# Altium project bogo_board.PrjPcb (part 3 of 4)
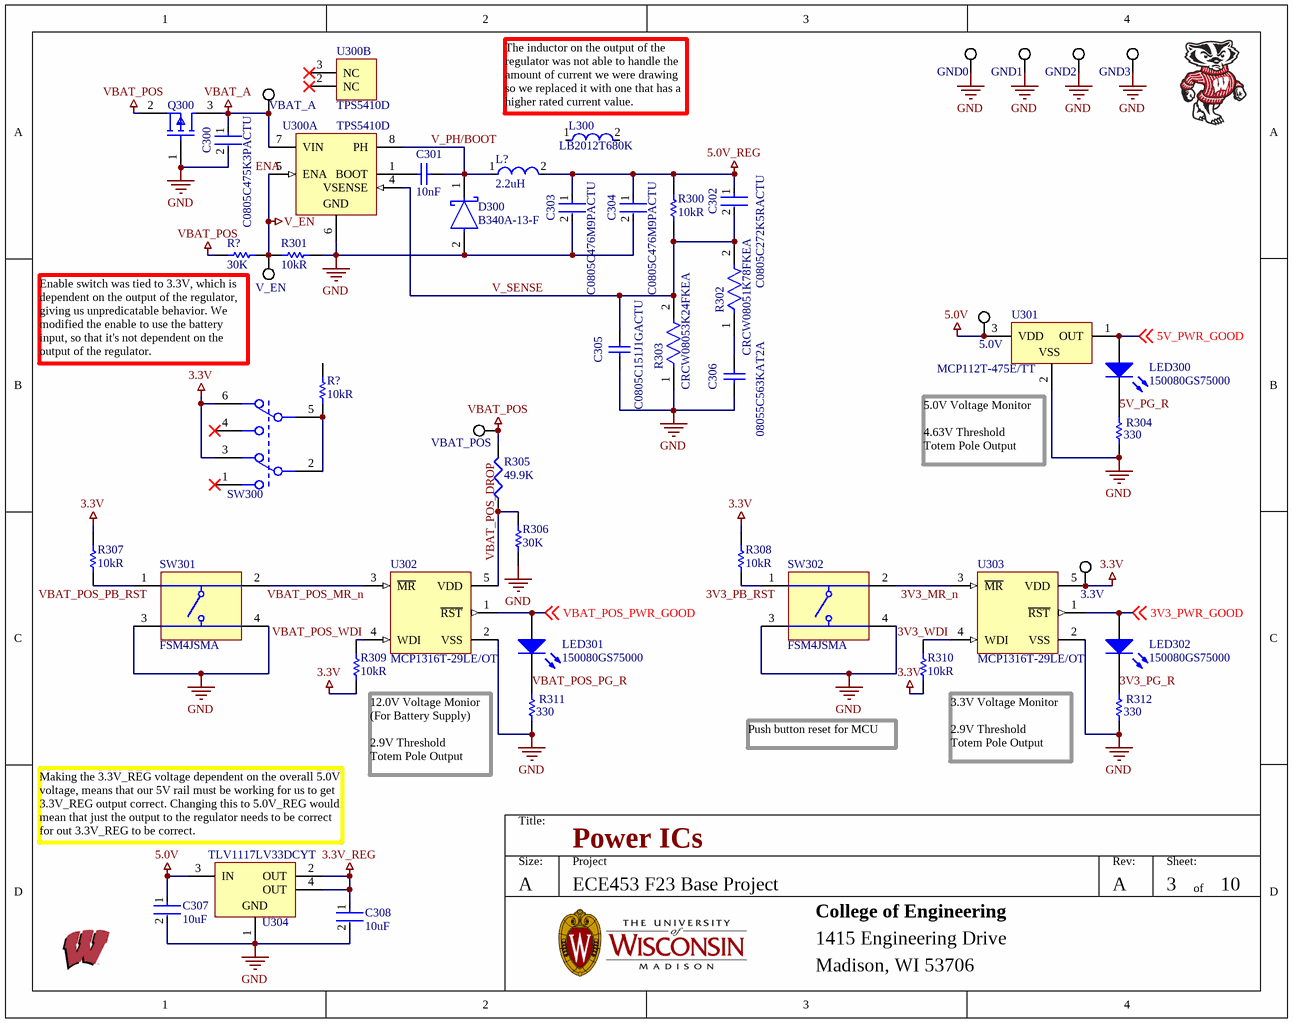
[diagram p11: 03_Power_ICs.SchDoc]

## Sheet 03_Power_ICs.SchDoc: Power ICs (continued)

### Library data of the parts (continued)
SW300 = JS202011SCQN: C & K COMPONENTS - JS202011SCQN - SWITCH, DPDT, 0.6A, 6VDC, SMD; Manufacturer 1: ITT C&K; Actuator Material: Nylon,Polyamide,PA46; Actuator Color: Black; Voltage Rating (DC): 6V; Current Rating: 300mA; Electrical Life: 5000Cycles; Switch Function: On-On; Contact Resistance: 70mR; Switch Travel: 2mm; Actuator Type: Standard; Supplier 1: Digi-Key; Supplier Part Number 1: 401-2002-1-ND; Manufacturer Part Number 1: JS202011SCQN; RoHS: Yes; Category: Slide Switches; Stock 1: 21096; Pricing 1: 1=0.55000, 10=0.53000, 25=0.51040, 100=0.44180, 250=0.40252, 500=0.37306 (USD); Mount: Surface Mount; Contact Plating: Silver; Contact Material: Copper Alloy; Housing Material: Nylon; Min Operating Temperature: -20°C; Max Operating Temperature: 85°C; Throw Configuration: DPDT; Packaging: Tape and Reel; Package Quantity: 1; Termination: Gull Wing; Max Voltage Rating (DC): 6V; Series: JS; Max Current Rating: 300mA; Contact Current Rating: 300mA; Orientation: Vertical; Length: 9mm; Depth: 7.5mm; Actuator Length: 2mm; Radiation Hardening: No; REACH SVHC: No SVHC; Lead Free: Lead Free; Flammability Rating: UL94 V-2; ComponentLink1URL: https://datasheet.ciiva.com/2889/js-29aug13-2889127.pdf?src-supplier=Digi-Key; ComponentLink1Description: https://datasheet.ciiva.com/2889/js-29aug13-2889127.pdf?src-supplier=Digi-Key; ComponentLink2URL: https://datasheet.ciiva.com/23829/1707718-23829488.pdf?src-supplier=Newark; ComponentLink2Description: https://datasheet.ciiva.com/23829/1707718-23829488.pdf?src-supplier=Newark; ComponentLink3URL: https://datasheet.ciiva.com/8625/js-9dec14-8625470.pdf?src-supplier=Avnet; ComponentLink3Description: https://datasheet.ciiva.com/8625/js-9dec14-8625470.pdf?src-supplier=Avnet; ComponentLink4URL: https://datasheet.ciiva.com/2889/js-15sept15-2889128.pdf?src-supplier=Digi-Key; ComponentLink4Description: https://datasheet.ciiva.com/2889/js-15sept15-2889128.pdf?src-supplier=Digi-Key; ComponentLink5URL: https://datasheet.ciiva.com/2889/js-15sept15-2889129.pdf?src-supplier=Digi-Key; ComponentLink5Description: https://datasheet.ciiva.com/2889/js-15sept15-2889129.pdf?src-supplier=Digi-Key; ComponentLink6URL: https://datasheet.ciiva.com/22630/1707718-22630697.pdf?src-supplier=Element14; ComponentLink6Description: https://datasheet.ciiva.com/22630/1707718-22630697.pdf?src-supplier=Element14
SW301 SW302 = CMP-2000-05602-2: Swicth, SPST, 24 V, -35 to 85 degC, 4-Pin SMD, RoHS, Tape and Reel; Manufacturer: TE Connectivity; Switch Travel: 0.25mm; Mechanical Life: 100000Cycles; Contact Current Rating: 50mA; Operating Force: 1.57N; Actuator Material: Polyamide; Contact Resistance: 100mOhm; Voltage Rating: 24V; Illumination Type: Illuminated; Actuator Length: 0.055inch; Max Voltage Rating (DC): 12V; Case\/Package: SMD/SMT; Switch Function: Off-Mom; Actuator Type: Standard; Insulation Resistance: 100MR; Orientation: Straight; Datasheet URL: http://www.te.com/commerce/DocumentDelivery/DDEController?Action=showdoc&DocId=Customer+Drawing%7F2-1437565-7%7FV%7Fpdf%7FEnglish%7FENG_CD_2-1437565-7_V.pdf%7F4-1437565-2; Min Operating Temperature: -35degC; Packaging: LoosePiece; Termination: GullWing; Throw Configuration: SPST; Package Description: 4-Pin Surface Mount Device, Body 6 x 6 mm, Pitch 4.5 mm; Mounting Technology: SurfaceMount; Contact Plating: Silver; Datasheet Version: Rev. V, 02/2015; RoHSCompliant: true; Max Operating Temperature: 85degC; Length: 6mm; Voltage Rating (DC): 24V; Electrical Life: 100000Cycles; Current Rating: 50mA; Package Quantity: 750; Mount: SurfaceMount; Package Reference: FSM4JSMA; Manufacturer URL: http://www.te.com/; Width: 6mm; REACH SVHC: Unknown; Contact Material: CopperAlloy; Supplier 1: Digi-Key; Supplier Part Number 1: 450-1129-ND; Manufacturer 1: TE Connectivity; Manufacturer Part Number 1: FSM4JSMA; RoHS: Yes; Category: Pushbutton Switches; Stock 1: 65608; Pricing 1: 1=0.27000, 10=0.26300, 25=0.24960, 100=0.22600, 250=0.20604, 750=0.19152, 1500=0.16339, 3000=0.15885, 5250=0.14977 (USD); Case/Package: SMD/SMT; Color: Black; Series: FSMJSMA; Max Current Rating: 50mA; Depth: 10mm; Radiation Hardening: No; RoHS Compliant: Yes; Lead Free: Lead Free; ELV: Compliant; Supplier: Newark; Supplier Part Number: 27AC5877; Manufacturer Part Number: FSM4JSMA; Stock: 46743; Pricing: 1=0.292, 10=0.274, 25=0.255, 100=0.232, 500=0.2, 1000=0.166 (USD); Reach SVHC Compliant: Unknown
U300 = CMP-0323-00191-3: Buck Step Down Regulator with 5.5 to 36 V Input and 1.23 to 31 V Output, -40 to 125 degC, 8-Pin SOIC (D), Green (RoHS & no Sb/Br); Manufacturer: Texas Instruments; Switch Current Limit(Typ)(A): 1.2; Iq(Typ)(mA): 3; Rating: Catalog; Duty Cycle(Max)(%): 87.5; Iout(Max)(A): 1; Vin(Max)(V): 36; Vout(Min)(V): 1.23; Vout(Max)(V): 31; SubFamily: Step-Down Regulator; Vin(Min)(V): 5.5; Package Body Material: Plastic; Throw Configuration: SWITCHING REGULATOR; Control Technique: PULSE WIDTH MODULATION; Max Supply Voltage: 36V; Min Input Voltage: 5.5V; Max Output current: 1.8A; Frequency: 600kHz; Control Mode: VOLTAGE-MODE; Package Equivalence Code: SOP8,.25; Qualification Status: Not Qualified; ComponentLink2URL: http://www.ti.com/litv/pdf/msoi002j; PartNumber: TPS5410D; DatasheetVersion: SLVS675A; PackageDescription: 8-Pin Plastic Small Outline Integrated Circuit, 4.9 x 3.9 mm, Pitch 1.27 mm Pitch; Topology: Buck; PackageVersion: revM, Jun-2011; Code_JEDEC: MS-012AA; ComponentLink3Description: URL Link1; ComponentLink1Description: Datasheet; ComponentLink1URL: http://www.ti.com/general/docs/lit/getliterature.tsp?genericPartNumber=TPS5410&fileType=pdf; Eco-Plan: Green (RoHS & no Sb/Br); ComponentLink3URL: Samples URL:http://www.ti.com/product/tps5410#samples; Mounting Technology: Surface Mount; ComponentLink2Description: Package Specification; PackageReference: D0008A; Regulated Outputs(#): 1; Supplier: Digi-Key; Supplier Part Number: 296-20787-5-ND; Manufacturer Part Number: TPS5410D; RoHS: Yes; Category: Voltage Regulators - Switching; Stock: 6339; Pricing: 1=3.42, 10=3.072, 25=2.9044, 100=2.517, 250=2.38796, 500=2.1427, 1000=1.80709, 2500=1.71674, 5000=1.6522 (USD); Case/Package: SOP; Pins: 8; Package Shape: Rectangular; Terminal Finish: Nickel; Min Operating Temperature: -40°C; Max Operating Temperature: 125°C; JESD-609 Code: e4; Moisture Sensitivity Level: 2; Channels: 1; Package Style: SMALL OUTLINEMeter; Surface Mount: Yes; Switcher Configuration: BUCK; Terminal Form: Gull Wing; Terminal Position: DUAL; Peak Reflow Temperature (Cel): 260°C; JESD-30 Code: R-PDSO-G8; Length: 4.9mm; Width: 3.9mm; Height - Seated (Max): 1.75mm; Terminal Pitch: 1.27mm; Temperature Grade: AUTOMOTIVE; Reach SVHC Compliant: Yes; RoHS Compliant: Yes; ComponentLink4URL: https://www.ti.com:443/lit/ds/symlink/tps5410.pdf?src-supplier=IHS+Markit; ComponentLink4Description: https://www.ti.com:443/lit/ds/symlink/tps5410.pdf?src-supplier=IHS+Markit; ComponentLink5URL: https://datasheet.ciiva.com/15113/getdatasheetpartid-224296-15113874.pdf?src-supplier=Verical; ComponentLink5Description: https://datasheet.ciiva.com/15113/getdatasheetpartid-224296-15113874.pdf?src-supplier=Verical; ComponentLink6URL: https://datasheet.ciiva.com/2026/tps5410-2026736.pdf?src-supplier=Digi-Key; ComponentLink6Description: https://datasheet.ciiva.com/2026/tps5410-2026736.pdf?src-supplier=Digi-Key; ComponentLink7URL: https://datasheet.ciiva.com/27056/2003563-27056017.pdf?src-supplier=Jameco; ComponentLink7Description: https://datasheet.ciiva.com/27056/2003563-27056017.pdf?src-supplier=Jameco; ComponentLink8URL: https://datasheet.ciiva.com/7993/1851017-7993797.pdf?src-supplier=Element14; ComponentLink8Description: https://datasheet.ciiva.com/7993/1851017-7993797.pdf?src-supplier=Element14
U301 = CMP-0130-00073-1: 1.75Î¼A Micropower Voltage Detector, Push-Pull Output, 4.63V, 3-Pin SOT-23, Extended Temperature, Tape and Reel; Manufacturer: Microchip; Package Body Material: Plastic; Adjustable Threshold: No; Throw Configuration: POWER SUPPLY SUPPORT CIRCUIT; Number of Channels: 1; Package Equivalence Code: TO-236; Power Supplies: 1/5.5V; Supply Current-Max (Isup): 1.75uA; Max Supply Voltage: 5.5V; Min Supply Voltage: 1V; Time @ Peak Reflow Temperature-Max (s): 40s; Qualification Status: Not Qualified; PackageReference: SOT-23-TT3; DatasheetVersion: revD, Jun-2005; Code_IPC: SOT23-3; PackageDescription: 3-Lead Plastic Small Outline Transistor (TT) [SOT-23]; PackageVersion: revBB, Aug-2009; Supplier: Digi-Key; Supplier Part Number: MCP112T-475E/TTCT-ND; Manufacturer Part Number: MCP112T-475E/TT; RoHS: Yes; Category: Voltage Supervisors; Stock: 2856; Pricing: 1=0.6, 25=0.5, 100=0.46 (USD); Case/Package: TSSOP; Pins: 3; Package Shape: Rectangular; Terminal Finish: Tin; Min Operating Temperature: -40°C; Max Operating Temperature: 125°C; JESD-609 Code: e3; JESD-30 Code: R-PDSO-G3; Moisture Sensitivity Level: 1; Channels: 1; Package Style: SMALL OUTLINE, THIN PROFILE, SHRINK PITCHMeter; Peak Reflow Temperature (Cel): 260°C; Surface Mount: Yes; Terminal Form: Gull Wing; Terminal Position: DUAL; Threshold Voltage-Nom: 4.63V; Length: 2.92mm; Width: 1.3mm; Height - Seated (Max): 1.12mm; Terminal Pitch: 0.96mm; Temperature Grade: AUTOMOTIVE; Reach SVHC Compliant: Yes; RoHS Compliant: Yes; ComponentLink1URL: https://datasheet.ciiva.com:443/pdfs/VipMasterIC/IC/MCHP/MCHP-S-A0002312823/MCHP-S-A0002312823-1.pdf?src-supplier=IHS+Markit; ComponentLink1Description: https://datasheet.ciiva.com:443/pdfs/VipMasterIC/IC/MCHP/MCHP-S-A0002312823/MCHP-S-A0002312823-1.pdf?src-supplier=IHS+Markit; ComponentLink2URL: https://datasheet.ciiva.com/1974/21889d-1974510.pdf?src-supplier=Digi-Key; ComponentLink2Description: https://datasheet.ciiva.com/1974/21889d-1974510.pdf?src-supplier=Digi-Key; ComponentLink3URL: https://datasheet.ciiva.com/1974/21889d-1974511.pdf?src-supplier=Digi-Key; ComponentLink3Description: https://datasheet.ciiva.com/1974/21889d-1974511.pdf?src-supplier=Digi-Key; ComponentLink4URL: https://datasheet.ciiva.com/1974/21889d-1974512.pdf?src-supplier=Digi-Key; ComponentLink4Description: https://datasheet.ciiva.com/1974/21889d-1974512.pdf?src-supplier=Digi-Key; ComponentLink5URL: https://datasheet.ciiva.com/9215/21889d-9215465.pdf?src-supplier=Avnet; ComponentLink5Description: https://datasheet.ciiva.com/9215/21889d-9215465.pdf?src-supplier=Avnet; ComponentLink6URL: https://datasheet.ciiva.com/1170/21889d-1170331.pdf?src-supplier=Element14; ComponentLink6Description: https://datasheet.ciiva.com/1170/21889d-1170331.pdf?src-supplier=Element14
U302 U303 = CMP-0138-00207-1: Voltage Supervisor, 5-Pin SOT-23, Extended Temperature, Tape and Reel; Manufacturer: Microchip; Min Supply Voltage: 1V; Max Supply Voltage: 5.5V; Number of Voltages Monitored: 1; Overvoltage Threshold: 2.944V; Undervoltage Threshold: 2.857V; Operating Supply Current: 10uA; Reset: Active Low; Reset Timeout: 140ms; Threshold Voltage: 2.9V; Watchdog Timer: Yes; Quiescent Current: 1uA; Max Output current: 10mA; Max Power Dissipation: 240mW; Output: TOTEM-POLE; PackageReference: SOT-23-OT5; Code_IPC: SOT23-5; DatasheetVersion: revB, Oct-2007; PackageDescription: 5-Lead Plastic Small Outline Transistor (OT) [SOT-23]; PackageVersion: revBB, Aug-2009; Supplier: Newark; Supplier Part Number: 34M7402; Manufacturer Part Number: MCP1316T-29LE/OT; RoHS: Yes; Category: Voltage Supervisors; Stock: 8598; Pricing: 1=0.877, 10=0.805, 25=0.732 (USD); Mounting Technology: Surface Mount; Case/Package: SOT-23; Pins: 5; Min Operating Temperature: -40°C; Max Operating Temperature: 125°C; Packaging: Tape and Reel; Type: Simple Reset/Power-On Reset; Package Quantity: 3000; Max Supply Current: 10uA; Max Reset Threshold Voltage: 2.944V; Min Reset Threshold Voltage: 2.857V; Supply Current: 10uA; Number of Elements: 1; Power Dissipation: 240mW; Termination: SMD/SMT; Length: 3.1mm; Width: 1.8mm; Height: 1.3mm; Radiation Hardening: No; Reach SVHC Compliant: No; Lead Free: Lead Free; RoHS Compliant: Yes; ComponentLink1URL: https://datasheet.ciiva.com/1969/21985d-1969832.pdf?src-supplier=Digi-Key; ComponentLink1Description: https://datasheet.ciiva.com/1969/21985d-1969832.pdf?src-supplier=Digi-Key; ComponentLink2URL: https://datasheet.ciiva.com/1969/21985d-1969833.pdf?src-supplier=Digi-Key; ComponentLink2Description: https://datasheet.ciiva.com/1969/21985d-1969833.pdf?src-supplier=Digi-Key; ComponentLink3URL: https://datasheet.ciiva.com/14562/70045388-14562791.pdf?src-supplier=Allied+Electronics; ComponentLink3Description: https://datasheet.ciiva.com/14562/70045388-14562791.pdf?src-supplier=Allied+Electronics; ComponentLink4URL: https://datasheet.ciiva.com/8140/21985c-8140440.pdf?src-supplier=Avnet; ComponentLink4Description: https://datasheet.ciiva.com/8140/21985c-8140440.pdf?src-supplier=Avnet
U304 = CMP-0395-00499-2: Single Output LDO, 1 A, Fixed 3.3 V Output, 2 to 5.5 V Input, 4-pin SOT-223 (DCY), -40 to 125 degC, Green (RoHS & no Sb/Br); Manufacturer: Texas Instruments; Manufacturer Part Number: TLV1117-33CDCYR; Vout Adj(Max)(V): 3.3; Iout(Max)(A): 1; SubFamily: Single Channel LDO; Iq(Typ)(mA): 0.05; Accuracy(%): 2; Vin(Max)(V): 5.5; Vdo(Typ)(mV): 1200; Max Power Dissipation: 1.59W; Dropout Voltage: 455mV; Output Voltage: 3.3V; Output Current: 1A; Max Input Voltage: 5.5V; Min Input Voltage: 2V; Min Current Limit: 1.1A; Polarity: Positive; Quiescent Current: 50uA; Output Voltage Accuracy: 1.5%; Accuracy: 2%; Power Supply Rejection Ratio (PSRR): 75dB; Max Supply Voltage: 15V; PartNumber: TLV1117LV33DCYT; PackageReference: DCY0004A; PackageVersion: 4202506/B; ComponentLink1URL: http://www.ti.com/; DatasheetVersion: SBVS160A; Mounting Technology: Surface Mount; Fixed Output Options(V): 3.3; ComponentLink3Description: Package Specification; PackageDescription: 4-Pin Plastic Small Outline, Body 3.5 x 6.5 mm, Pitch 2.3 mm; Vout Adj(Min)(V): 3.3; ComponentLink2URL: http://www.ti.com/general/docs/lit/getliterature.tsp?genericPartNumber=TLV1117LV33&fileType=pdf; Code_JEDEC: TO-261; ComponentLink1Description: Manufacturer URL; Vin(Min)(V): 2; ComponentLink2Description: Datasheet; Eco-Plan: Green (RoHS & no Sb/Br); ComponentLink3URL: http://www.ti.com/litv/pdf/mpds094a; Supplier 1: Digi-Key; Supplier Part Number 1: 296-35976-1-ND; Manufacturer 1: Texas Instruments; Manufacturer Part Number 1: TLV1117LV33DCYT; RoHS: Yes; Category: Voltage Regulators - Linear; Stock 1: 1411; Pricing 1: 1=1.15000, 10=1.02600, 25=0.97360, 100=0.79970 (USD); Case/Package: SOT-223; Number of Pins: 4; Contact Plating: Tin; Min Operating Temperature: -40°C; Max Operating Temperature: 125°C; Package Quantity: 250; Packaging: Tape and Reel; Number of Outputs: 1; Nominal Output Voltage: 3.3V; Max Output Current: 1A; Number of Regulators: 1; Power Dissipation: 1.59W; Max Output Voltage: 3.3V; Min Output Voltage: 3.3V; Output Type: Fixed; Series: -; Output Configuration: Positive; Radiation Hardening: No; Reach SVHC Compliant: Yes; Lead Free: Lead Free; RoHS Compliant: Yes; ComponentLink4URL: http://www.ti.com/general/docs/lit/getliterature.tsp?genericPartNumber=TLV1117LV&&fileType=pdf&src-supplier=Farnell; ComponentLink4Description: http://www.ti.com/general/docs/lit/getliterature.tsp?genericPartNumber=TLV1117LV&&fileType=pdf&src-supplier=Farnell; ComponentLink5URL: http://www.farnell.com/datasheets/1950591.pdf?src-supplier=Element14; ComponentLink5Description: http://www.farnell.com/datasheets/1950591.pdf?src-supplier=Element14; ComponentLink6URL: http://www.ti.com/lit/ds/symlink/tlv1117lv.pdf?src-supplier=Digi-Key; ComponentLink6Description: http://www.ti.com/lit/ds/symlink/tlv1117lv.pdf?src-supplier=Digi-Key; ComponentLink7URL: http://www.ti.com/general/docs/suppproductinfo.tsp?distId=10&amp;gotoUrl=http%3A%2F%2Fwww.ti.com%2Flit%2Fgpn%2Ftlv1117lv&src-supplier=Digi-Key; ComponentLink7Description: http://www.ti.com/general/docs/suppproductinfo.tsp?distId=10&amp;gotoUrl=http%3A%2F%2Fwww.ti.com%2Flit%2Fgpn%2Ftlv1117lv&src-supplier=Digi-Key; ComponentLink8URL: http://www.ti.com/lit/gpn/tlv1117lv?src-supplier=Mouser; ComponentLink8Description: http://www.ti.com/lit/gpn/tlv1117lv?src-supplier=Mouser; ComponentLink9URL: http://www.ti.com/general/docs/lit/getliterature.tsp?genericPartNumber=TLV1117LV&&fileType=pdf&src-supplier=Avnet; ComponentLink9Description: http://www.ti.com/general/docs/lit/getliterature.tsp?genericPartNumber=TLV1117LV&&fileType=pdf&src-supplier=Avnet; ComponentLink10URL: http://components.arrow.com/part/dataview/51117919S8954709N7713?src-supplier=Arrow+Electronics; ComponentLink10Description: http://components.arrow.com/part/dataview/51117919S8954709N7713?src-supplier=Arrow+Electronics; Supplier: Newark; Supplier Part Number: 29AH1523; Pricing: 1=0.965, 10=0.923, 25=0.877, 50=0.839, 100=0.803, 250=0.777, 500=0.759, 1000=0.746 (USD); Pins: 3; ComponentLink11URL: http://www.ti.com/general/docs/lit/getliterature.tsp?genericPartNumber=TLV1117-33&amp;&amp;fileType=pdf&src-supplier=Newark; ComponentLink11Description: http://www.ti.com/general/docs/lit/getliterature.tsp?genericPartNumber=TLV1117-33&amp;&amp;fileType=pdf&src-supplier=Newark; ComponentLink12URL: http://www.ti.com/general/docs/suppproductinfo.tsp?distId=10&amp;gotoUrl=http%3A%2F%2Fwww.ti.com%2Flit%2Fgpn%2Ftlv1117&src-supplier=Digi-Key; ComponentLink12Description: http://www.ti.com/general/docs/suppproductinfo.tsp?distId=10&amp;gotoUrl=http%3A%2F%2Fwww.ti.com%2Flit%2Fgpn%2Ftlv1117&src-supplier=Digi-Key

## Sheet 10_Mechanical.SchDoc: Mechanicals
size A; Revision: A; SheetNumber: 10; SheetTotal: 10; ECE315_Project_Name: ECE453 Base Project
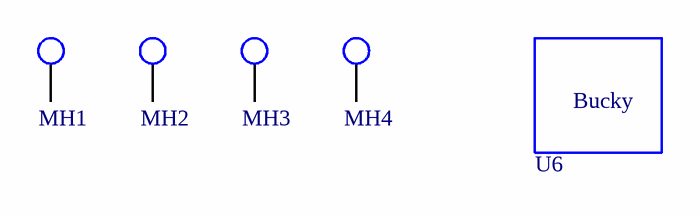
[diagram p4: 10_Mechanical.SchDoc]

### Parts
MH1  MHOLE_2_55MM  [MHOLE_2_55MM]  (value not drawn)  (no BOM)
MH2  MHOLE_2_55MM  [MHOLE_2_55MM]  (value not drawn)  (no BOM)
MH3  MHOLE_2_55MM  [MHOLE_2_55MM]  (value not drawn)  (no BOM)
MH4  MHOLE_2_55MM  [MHOLE_2_55MM]  (value not drawn)  (no BOM)
U6  Bucky  [WalkingBucky]  (value not drawn)  (no BOM)

### Nets

Not connected (* = marked no-connect by the designer): MH1 1; MH2 1; MH3 1; MH4 1

### Notes on the sheet
- Title:
- Size:
- A
- Project
- Rev:
- Sheet:
- of
- College of Engineering
- 1415 Engineering Drive
- Madison, WI 53706

### Library data of the parts
MH1-MH4 = MHOLE_2_55MM: Mounting Holde; Manufacturer Part Number: UW MTHOLE
U6 = Bucky: Bucky Badger Image; Manufacturer Part Number: UW Bucky

## Sheet 02_Connectors.SchDoc: Connectors
size A; Revision: A; SheetNumber: 2; SheetTotal: 10; ECE315_Project_Name: ECE453 Processor Mezzanine
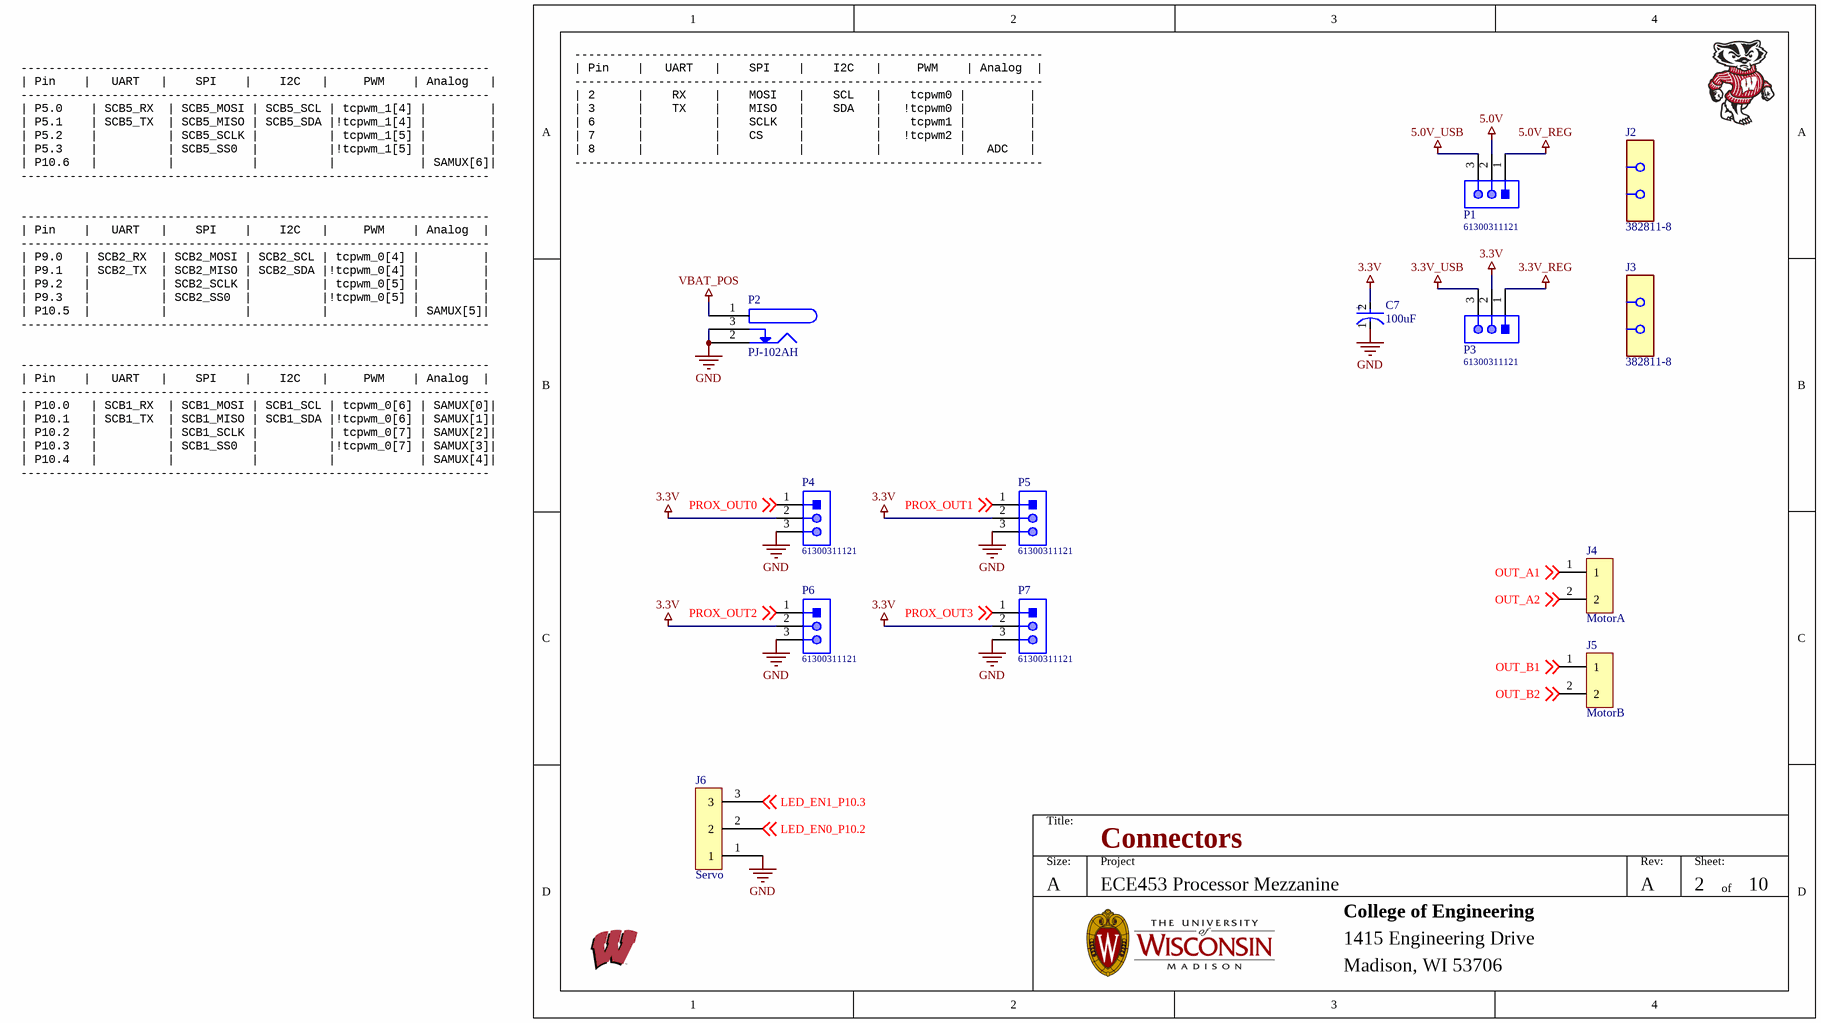
[diagram p5: 02_Connectors.SchDoc]

### Parts
C7  Capacitance: 100uF  [FP-SD8-MFG]  (hidden comment: EEE-1EA101XP)
J2  382811-8  [FP-382811-8-MFG]
J3  382811-8  [FP-382811-8-MFG]
J4  MotorA  [PHOENIX2X0.2]
J5  MotorB  [PHOENIX2X0.2]
J6  Servo  [PHOENIX3X0.2]
P1  61300311121  [61300311121]
P2  Manufacturer Part Number: PJ-102AH  [PJ-102]  (hidden comment: PJ-102)
P3  61300311121  [61300311121]
P4  61300311121  [61300311121]
P5  61300311121  [61300311121]
P6  61300311121  [61300311121]
P7  61300311121  [61300311121]

### Nets
3.3V: C7.2(A) P3.2 P4.2 P5.2 P6.2 P7.2
3.3V_REG: P3.1
3.3V_USB: P3.3
5.0V: P1.2
5.0V_REG: P1.1
5.0V_USB: P1.3
GND: C7.1(C) J6.1 P2.2 P2.3 P4.3 P5.3 P6.3 P7.3
VBAT_POS: P2.1
LED_EN0_P10.2: J6.2 ; off-sheet LED_EN0_P10.2
LED_EN1_P10.3: J6.3 ; off-sheet LED_EN1_P10.3
OUT_A1: J4.1 ; off-sheet OUT_A1
OUT_A2: J4.2 ; off-sheet OUT_A2
OUT_B1: J5.1 ; off-sheet OUT_B1
OUT_B2: J5.2 ; off-sheet OUT_B2
PROX_OUT0: P4.1 ; off-sheet PROX_OUT0
PROX_OUT1: P5.1 ; off-sheet PROX_OUT1
PROX_OUT2: P6.1 ; off-sheet PROX_OUT2
PROX_OUT3: P7.1 ; off-sheet PROX_OUT3

### Notes on the sheet
- -------------------------------------------------------------------
  | Pin    |   UART   |    SPI    |    I2C   |     PWM    | Analog   |
  -------------------------------------------------------------------
  | P5.0    | SCB5_RX  | SCB5_MOSI | SCB5_SCL | tcpwm_1[4] |         |
  | P5.1    | SCB5_TX  | SCB5_MISO | SCB5_SDA |!tcpwm_1[4] |         |
  | P5.2    |          | SCB5_SCLK |          | tcpwm_1[5] |         |
  | P5.3    |          | SCB5_SS0  |          |!tcpwm_1[5] |         |
  | P10.6   |          |           |          |            | SAMUX[6]|
  -------------------------------------------------------------------
- -------------------------------------------------------------------
  | Pin    |   UART   |    SPI    |    I2C   |     PWM    | Analog  |
  -------------------------------------------------------------------
  | 2      |    RX    |    MOSI   |    SCL   |    tcpwm0 |         |
  | 3      |    TX    |    MISO   |    SDA   |   !tcpwm0 |         |
  | 6      |          |    SCLK   |          |    tcpwm1 |         |
  | 7      |          |    CS     |          |   !tcpwm2 |         |
  | 8      |          |           |          |           |   ADC   |
  -------------------------------------------------------------------
- -------------------------------------------------------------------
  | Pin    |   UART   |    SPI    |    I2C   |     PWM    | Analog  |
  -------------------------------------------------------------------
  | P9.0   | SCB2_RX  | SCB2_MOSI | SCB2_SCL | tcpwm_0[4] |         |
  | P9.1   | SCB2_TX  | SCB2_MISO | SCB2_SDA |!tcpwm_0[4] |         |
  | P9.2   |          | SCB2_SCLK |          | tcpwm_0[5] |         |
  | P9.3   |          | SCB2_SS0  |          |!tcpwm_0[5] |         |
  | P10.5  |          |           |          |            | SAMUX[5]|
  -------------------------------------------------------------------
- -------------------------------------------------------------------
  | Pin    |   UART   |    SPI    |    I2C   |     PWM    | Analog  |
  -------------------------------------------------------------------
  | P10.0   | SCB1_RX  | SCB1_MOSI | SCB1_SCL | tcpwm_0[6] | SAMUX[0]|
  | P10.1   | SCB1_TX  | SCB1_MISO | SCB1_SDA |!tcpwm_0[6] | SAMUX[1]|
  | P10.2   |          | SCB1_SCLK |          | tcpwm_0[7] | SAMUX[2]|
  | P10.3   |          | SCB1_SS0  |          |!tcpwm_0[7] | SAMUX[3]|
  | P10.4   |          |           |          |            | SAMUX[4]|
  -------------------------------------------------------------------
- Title:
- Size:
- A
- Project
- Rev:
- Sheet:
- of
- College of Engineering
- 1415 Engineering Drive
- Madison, WI 53706
- (in symbol CMP-05427-000061-1) +

### Library data of the parts
C7 = CMP-05427-000061-1: CAP ALUM 100UF 20% 25V SMD; Manufacturer: Panasonic; Leakage Current: 3uA; Life (Hours): 2000Hour; Ripple Current: 143mA; Polarity: Polar; Height - Seated (Max): 0.303inch; Contact Plating: Tin; Max Operating Temperature: 85°C; Package Quantity: 900; RoHS Compliant: Yes; Termination: SMD/SMT; Lead Free: Lead Free; Min Operating Temperature: -40°C; Radiation Hardening: No; Length: 8mm; Height: 7.7mm; Series: S; Voltage Rating: 25V; Diameter: 6.3mm; Ripple Current (AC): 143mA; Case/Package: Radial; Packaging: Tape and Reel; Voltage: 25V; Tolerance: 20%; Construction: Cylindrical; Voltage Rating (DC): 25V; Mount: Surface Mount; Supplier: Newark; Supplier Part Number: 47AC4798; Manufacturer Part Number: EEE-1EA101XP; RoHS: Yes; Category: Aluminum Electrolytic Capacitors; Stock: 12600; Pricing: 1=0.166, 900=0.162, 1800=0.158 (USD); Mounting Technology: Surface Mount,PCB; Value: 100uF; Ratings: AEC-Q200; Reach SVHC Compliant: Unknown; ComponentLink1URL: https://media.digikey.com/pdf/Data%20Sheets/Panasonic%20Electronic%20Components/S_Series,Type_V_Rev2018.pdf?src-supplier=Digi-Key; ComponentLink1Description: https://media.digikey.com/pdf/Data%20Sheets/Panasonic%20Electronic%20Components/S_Series,Type_V_Rev2018.pdf?src-supplier=Digi-Key; ComponentLink2URL: https://industrial.panasonic.com/cdbs/www-data/pdf/RDE0000/DME0000COL90.pdf?src-supplier=Digi-Key; ComponentLink2Description: https://industrial.panasonic.com/cdbs/www-data/pdf/RDE0000/DME0000COL90.pdf?src-supplier=Digi-Key; ComponentLink3URL: https://industrial.panasonic.com/cdbs/www-data/pdf/RDE0000/DME0000COL90.pdf?src-supplier=Arrow+Electronics; ComponentLink3Description: https://industrial.panasonic.com/cdbs/www-data/pdf/RDE0000/DME0000COL90.pdf?src-supplier=Arrow+Electronics
J2 J3 = CMP-03355-000020-1: CONN SHUNT 2POS OPEN 2.54MM; Manufacturer 1: TE Connectivity; Number of Positions: 2; Current Rating: 3A; Approvals: UL; Plating Thickness: 0.127um; Insulation Resistance: 1GR; Max Operating Temperature: 105°C; Housing Material: Polyester; Flammability Rating: UL94 V-0; Package Quantity: 1500; Contact Current Rating: 3A; Pitch: 2.54mm; Height: 6.35mm; Lead Free: Lead Free; Contact Gender: Female; Length: 5.08mm; Color: Black; Housing Color: Black; Min Operating Temperature: -65°C; Series: AMPMODU; Depth: 2.54mm; Number of Rows: 1; Orientation: Straight; Number of Contacts: 2; Contact Plating: Gold; ELV: Compliant; Radiation Hardening: No; Contact Material: Bronze; Packaging: Box; Supplier 1: Digi-Key; Supplier Part Number 1: A26228-ND; Manufacturer Part Number 1: 382811-8; RoHS: Yes; Category: Board to Board Connectors; Stock 1: 342640; Pricing 1: 10=0.192, 30=0.17833, 50=0.169, 100=0.1599, 250=0.14884, 500=0.14026, 1000=0.1329, 2500=0.1231, 5000=0.11147 (USD); Reach SVHC Compliant: Unknown; RoHS Compliant: Yes; ComponentLink1URL: https://datasheet.ciiva.com/25616/0900766b810caf26-25616808.pdf?src-supplier=Rs; ComponentLink1Description: https://datasheet.ciiva.com/25616/0900766b810caf26-25616808.pdf?src-supplier=Rs; ComponentLink2URL: https://datasheet.ciiva.com/767/eng-cd-382811-l-767846.pdf?src-supplier=Digi-Key; ComponentLink2Description: https://datasheet.ciiva.com/767/eng-cd-382811-l-767846.pdf?src-supplier=Digi-Key; ComponentLink3URL: https://datasheet.ciiva.com/30253/eng-cs-1307819-section-6-7and8-0808-30253247.pdf?src-supplier=Onlinecomponents.com; ComponentLink3Description: https://datasheet.ciiva.com/30253/eng-cs-1307819-section-6-7and8-0808-30253247.pdf?src-supplier=Onlinecomponents.com; ComponentLink4URL: https://datasheet.ciiva.com/14640/70083050-14640423.pdf?src-supplier=Allied+Electronics; ComponentLink4Description: https://datasheet.ciiva.com/14640/70083050-14640423.pdf?src-supplier=Allied+Electronics; ComponentLink5URL: https://datasheet.ciiva.com/1412/eng-cs-1307819-section-6-7and8-0808-1412631.pdf?src-supplier=Element14; ComponentLink5Description: https://datasheet.ciiva.com/1412/eng-cs-1307819-section-6-7and8-0808-1412631.pdf?src-supplier=Element14; ComponentLink6URL: https://datasheet.ciiva.com/3120/eng-cs-1307819-section-6-7and8-0808-3120187.pdf?src-supplier=Avnet; ComponentLink6Description: https://datasheet.ciiva.com/3120/eng-cs-1307819-section-6-7and8-0808-3120187.pdf?src-supplier=Avnet; Supplier: Newark; Supplier Part Number: 52F5498; Manufacturer: TE Connectivity; Manufacturer Part Number: 382811-8; Stock: 6205; Pricing: 1=0.255, 10=0.171, 25=0.156, 100=0.14, 500=0.131, 1000=0.105 (USD)
J4 J5 = 2-Pin: 2~24 Poles, Screw Type, Horizontal, 5.08 Pitch, 26~14 (AWG), Terminal Block Connector; Manufacturer: CUI Devices; Manufacturer Part Number: TB006-508-02BE; ComponentLink1URL: https://datasheet.ciiva.com/709/eng-cd-640456-w1-709680.pdf?src-supplier=Digi-Key; ComponentLink1Description: https://datasheet.ciiva.com/709/eng-cd-640456-w1-709680.pdf?src-supplier=Digi-Key; ComponentLink2URL: https://datasheet.ciiva.com/3118/eng-ds-82056-mta-0608-3118497.pdf?src-supplier=Avnet; ComponentLink2Description: https://datasheet.ciiva.com/3118/eng-ds-82056-mta-0608-3118497.pdf?src-supplier=Avnet; ComponentLink3URL: https://datasheet.ciiva.com/16401/eng-ds-82056-mta-0608-16401289.pdf?src-supplier=Future+Electronics; ComponentLink3Description: https://datasheet.ciiva.com/16401/eng-ds-82056-mta-0608-16401289.pdf?src-supplier=Future+Electronics; ComponentLink4URL: https://datasheet.ciiva.com/25617/0900766b80027008-25617244.pdf?src-supplier=RSComponents; ComponentLink4Description: https://datasheet.ciiva.com/25617/0900766b80027008-25617244.pdf?src-supplier=RSComponents; ComponentLink5URL: https://datasheet.ciiva.com/14156/04384301-14156820.pdf?src-supplier=Distrelec; ComponentLink5Description: https://datasheet.ciiva.com/14156/04384301-14156820.pdf?src-supplier=Distrelec; ComponentLink6URL: https://datasheet.ciiva.com/11746/0900766b80eb7fdd-11746365.pdf?src-supplier=RSComponents; ComponentLink6Description: https://datasheet.ciiva.com/11746/0900766b80eb7fdd-11746365.pdf?src-supplier=RSComponents; ComponentLink7URL: https://datasheet.ciiva.com/7128/1866390-7128742.pdf?src-supplier=Newark; ComponentLink7Description: https://datasheet.ciiva.com/7128/1866390-7128742.pdf?src-supplier=Newark; ComponentLink8URL: https://datasheet.ciiva.com/16505/eng-ds-82056-mta-0608-16505419.pdf?src-supplier=Avnet+Asia; ComponentLink8Description: https://datasheet.ciiva.com/16505/eng-ds-82056-mta-0608-16505419.pdf?src-supplier=Avnet+Asia; Supplier: Digi-Key; RoHS: Yes; Category: Terminal Blocks; Stock 1: 50889; Pricing 1: 1=0.86, 10=0.472, 25=0.3524, 50=0.3142, 100=0.308, 250=0.27108, 500=0.24644, 1000=0.2218, 5000=0.16635 (USD); Supplier Part Number: 102-6191-ND
J6 = 3-Pin_2: 2~24 Poles, Screw Type, Horizontal, 5.08 Pitch, 26~14 (AWG), Terminal Block Connector; Manufacturer: CUI Devices; Manufacturer Part Number: TB006-508-03BE; Supplier 1: Digi-Key; Supplier Part Number 1: 102-6192-ND; RoHS: Yes; Category: Terminal Blocks; Stock 1: 41909; Pricing 1: 1=0.91, 10=0.567, 25=0.4856, 50=0.4364, 100=0.4272, 250=0.3636, 500=0.34542, 1000=0.30906, 5000=0.24179 (USD)
P1 P3-P7 = CMP-1502-01062-1: THT Vertical Pin Header WR-PHD, Pitch 2.54 mm, Single Row, 3 pins; Manufacturer: Wurth Elektronik; Manufacturer 1: Wurth Electronics; Withstanding Voltage: 500VAC; Working Voltage: 250VAC; Rated Current: 3A; Pitch: 2.54mm; Pin Number: 3; Gender: Male; Contact Resistance: 20mOhm; Package Reference: 61300311121; Manufacturer URL: http://www.we-online.de; Datasheet URL: https://katalog.we-online.de/em/datasheet/6130xx11121.pdf; Operating Temperature: -40to105degC; Part Number: 61300311121; Orientation: Vertical; Packaging: Bag; Row Number: Single; Mounting Technology: THT; Publisher: WurthElektronik; Supplier 1: Digi-Key; Supplier Part Number 1: 732-5316-ND; Manufacturer Part Number 1: 61300311121; RoHS: Yes; Category: Connectors; Stock 1: 225106; Pricing 1: 1=0.13, 10=0.113, 25=0.094, 50=0.079, 100=0.071, 1000=0.066 (USD); Mount: Through Hole; Contact Plating: Gold; Contact Material: Copper; Color: Black; Number of Rows: 1; Number of Positions: 3; Termination: Solder; Number of Contacts: 3; Series: WR-PHD; Contact Type: Male Pin; Contact Mating Length: 0.236inch; Lead Free: Lead Free; RoHS Compliant: Yes; Reach SVHC Compliant: Unknown; ComponentLink1URL: http://www.farnell.com/cad/1737268.pdf?src-supplier=Element14; ComponentLink1Description: http://www.farnell.com/cad/1737268.pdf?src-supplier=Element14; ComponentLink2URL: https://katalog.we-online.de/em/datasheet/6130xx11121.pdf?src-supplier=Digi-Key; ComponentLink2Description: https://katalog.we-online.de/em/datasheet/6130xx11121.pdf?src-supplier=Digi-Key; Supplier: Newark; Supplier Part Number: 20X0950; Manufacturer Part Number: 61300311121; Stock: 65141; Pricing: 1=0.133, 10=0.115, 25=0.096, 50=0.081, 100=0.072 (USD); ComponentLink3URL: https://datasheet.octopart.com/61300311121-W%C3%BCrth-Elektronik-datasheet-21154836.pdf?src-supplier=Element14; ComponentLink3Description: https://datasheet.octopart.com/61300311121-W%C3%BCrth-Elektronik-datasheet-21154836.pdf?src-supplier=Element14
P2 = CONN JACK PWR W/SW: CONN PWR JACK 2.1X5.5MM HIGH CUR; Manufacturer: CUI Inc; Internal Switch(s): Single Switch, Normally Closed; Number of Positions/Contacts: 2 Conductors, 3 Contacts; Plug/Mating Plug Diameter: 2.1mm ID, 5.5mm OD; Gender: Male; Shielding: Unshielded; Voltage - Rated: 24VDC; Current Rating: 5A; Value: CP-102AD; Mounting Type: Through Hole, Right Angle; Supplier: Digi-Key; Connector Type: Jack; Supplier Part Number: CP-102AH-ND; Termination: Solder; Contact Material: Copper; Housing Material: Thermoplastic; Contact Material - Plating: Nickel; Housing Color: Black; Operating Temperature: -25°C ~ 85°C; Color: Black

## Sheet 07_MCU.SchDoc: PSoC6
size A; Revision: A; SheetNumber: 7; SheetTotal: 10; ECE315_Project_Name: ECE453 Processor Mezzanine
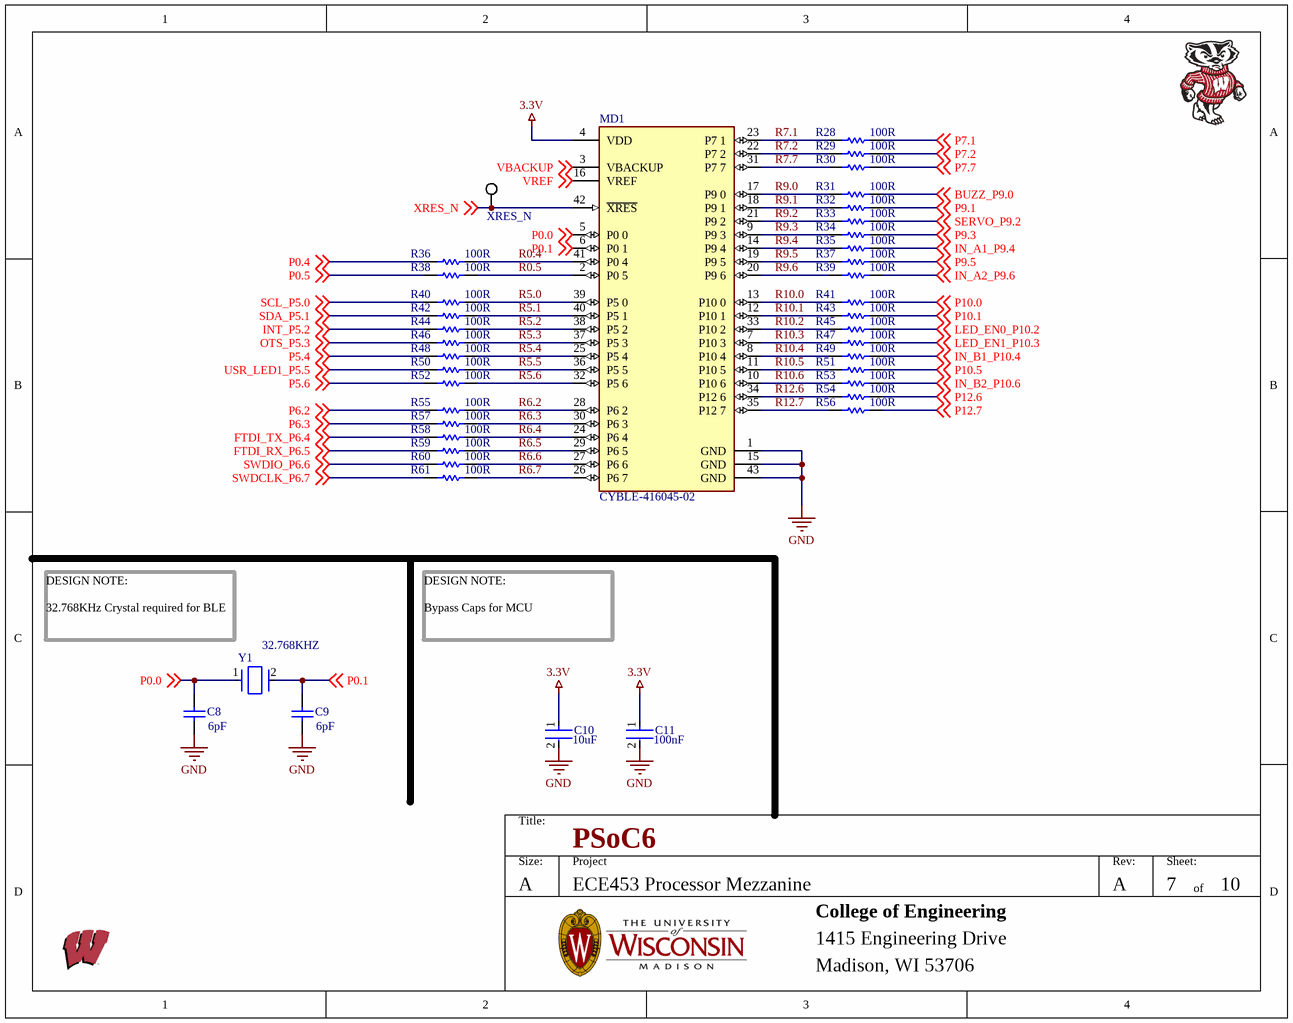
[diagram p6: 07_MCU.SchDoc]

### Parts
C8  value 6pF  [CAPC2013X94X50LL20T25]  (hidden comment: 08055A6R0CAT2A)
C9  value 6pF  [CAPC2013X94X50LL20T25]  (hidden comment: 08055A6R0CAT2A)
C10  value 10uF  [FP-C0805C-DG-MFG]  (hidden comment: C0805C106K8PACTU)
C11  value 100nF  [FP-C0805C-DN-MFG]  (hidden comment: C0805C104K5RACTU)
MD1  CYBLE-416045-02  [FP-CYBLE-416045-02-MFG]  (no BOM)
R28  value 100R  [RESC2013X60X40ML20T25]  (hidden comment: ERA6AEB101V)
R29  value 100R  [RESC2013X60X40ML20T25]  (hidden comment: ERA6AEB101V)
R30  value 100R  [RESC2013X60X40ML20T25]  (hidden comment: ERA6AEB101V)
R31  value 100R  [RESC2013X60X40ML20T25]  (hidden comment: ERA6AEB101V)
R32  value 100R  [RESC2013X60X40ML20T25]  (hidden comment: ERA6AEB101V)
R33  value 100R  [RESC2013X60X40ML20T25]  (hidden comment: ERA6AEB101V)
R34  value 100R  [RESC2013X60X40ML20T25]  (hidden comment: ERA6AEB101V)
R35  value 100R  [RESC2013X60X40ML20T25]  (hidden comment: ERA6AEB101V)
R36  value 100R  [RESC2013X60X40ML20T25]  (hidden comment: ERA6AEB101V)
R37  value 100R  [RESC2013X60X40ML20T25]  (hidden comment: ERA6AEB101V)
R38  value 100R  [RESC2013X60X40ML20T25]  (hidden comment: ERA6AEB101V)
R39  value 100R  [RESC2013X60X40ML20T25]  (hidden comment: ERA6AEB101V)
R40  value 100R  [RESC2013X60X40ML20T25]  (hidden comment: ERA6AEB101V)
R41  value 100R  [RESC2013X60X40ML20T25]  (hidden comment: ERA6AEB101V)
R42  value 100R  [RESC2013X60X40ML20T25]  (hidden comment: ERA6AEB101V)
R43  value 100R  [RESC2013X60X40ML20T25]  (hidden comment: ERA6AEB101V)
R44  value 100R  [RESC2013X60X40ML20T25]  (hidden comment: ERA6AEB101V)
R45  value 100R  [RESC2013X60X40ML20T25]  (hidden comment: ERA6AEB101V)
R46  value 100R  [RESC2013X60X40ML20T25]  (hidden comment: ERA6AEB101V)
R47  value 100R  [RESC2013X60X40ML20T25]  (hidden comment: ERA6AEB101V)
R48  value 100R  [RESC2013X60X40ML20T25]  (hidden comment: ERA6AEB101V)
R49  value 100R  [RESC2013X60X40ML20T25]  (hidden comment: ERA6AEB101V)
R50  value 100R  [RESC2013X60X40ML20T25]  (hidden comment: ERA6AEB101V)
R51  value 100R  [RESC2013X60X40ML20T25]  (hidden comment: ERA6AEB101V)
R52  value 100R  [RESC2013X60X40ML20T25]  (hidden comment: ERA6AEB101V)
R53  value 100R  [RESC2013X60X40ML20T25]  (hidden comment: ERA6AEB101V)
R54  value 100R  [RESC2013X60X40ML20T25]  (hidden comment: ERA6AEB101V)
R55  value 100R  [RESC2013X60X40ML20T25]  (hidden comment: ERA6AEB101V)
R56  value 100R  [RESC2013X60X40ML20T25]  (hidden comment: ERA6AEB101V)
R57  value 100R  [RESC2013X60X40ML20T25]  (hidden comment: ERA6AEB101V)
R58  value 100R  [RESC2013X60X40ML20T25]  (hidden comment: ERA6AEB101V)
R59  value 100R  [RESC2013X60X40ML20T25]  (hidden comment: ERA6AEB101V)
R60  value 100R  [RESC2013X60X40ML20T25]  (hidden comment: ERA6AEB101V)
R61  value 100R  [RESC2013X60X40ML20T25]  (hidden comment: ERA6AEB101V)
XRES_N  5019  [KSTN-5019_V]  (value not drawn)
Y1  32.768KHZ  [FP-ABS07-120-MFG]

### Nets
3.3V: C10.1 C11.1 MD1.4(VDD)
GND: C8.1 C9.1 C10.2 C11.2 MD1.1(GND) MD1.15(GND) MD1.43(GND)
BUZZ_P9.0: R31.2 ; off-sheet BUZZ_P9.0
FTDI_RX_P6.5: R59.1 ; off-sheet FTDI_RX_P6.5
FTDI_TX_P6.4: R58.1 ; off-sheet FTDI_TX_P6.4
IN_A1_P9.4: R35.2 ; off-sheet IN_A1_P9.4
IN_A2_P9.6: R39.2 ; off-sheet IN_A2_P9.6
IN_B1_P10.4: R49.2 ; off-sheet IN_B1_P10.4
IN_B2_P10.6: R53.2 ; off-sheet IN_B2_P10.6
INT_P5.2: R44.1 ; off-sheet INT_P5.2
LED_EN0_P10.2: R45.2 ; off-sheet LED_EN0_P10.2
LED_EN1_P10.3: R47.2 ; off-sheet LED_EN1_P10.3
OTS_P5.3: R46.1 ; off-sheet OTS_P5.3
P0.0: C8.2 MD1.5(P0_0) Y1.1 ; off-sheet P0.0
P0.1: C9.2 MD1.6(P0_1) Y1.2 ; off-sheet P0.1
P0.4: R36.1 ; off-sheet P0.4
P0.5: R38.1 ; off-sheet P0.5
P5.4: R48.1 ; off-sheet P5.4
P5.6: R52.1 ; off-sheet P5.6
P6.2: R55.1 ; off-sheet P6.2
P6.3: R57.1 ; off-sheet P6.3
P7.1: R28.2 ; off-sheet P7.1
P7.2: R29.2 ; off-sheet P7.2
P7.7: R30.2 ; off-sheet P7.7
P9.1: R32.2 ; off-sheet P9.1
P9.3: R34.2 ; off-sheet P9.3
P9.5: R37.2 ; off-sheet P9.5
P10.0: R41.2 ; off-sheet P10.0
P10.1: R43.2 ; off-sheet P10.1
P10.5: R51.2 ; off-sheet P10.5
P12.6: R54.2 ; off-sheet P12.6
P12.7: R56.2 ; off-sheet P12.7
R0.4: MD1.41(P0_4) R36.2
R0.5: MD1.2(P0_5) R38.2
R5.0: MD1.39(P5_0) R40.2
R5.1: MD1.40(P5_1) R42.2
R5.2: MD1.38(P5_2) R44.2
R5.3: MD1.37(P5_3) R46.2
R5.4: MD1.25(P5_4) R48.2
R5.5: MD1.36(P5_5) R50.2
R5.6: MD1.32(P5_6) R52.2
R6.2: MD1.28(P6_2) R55.2
R6.3: MD1.30(P6_3) R57.2
R6.4: MD1.24(P6_4) R58.2
R6.5: MD1.29(P6_5) R59.2
R6.6: MD1.27(P6_6) R60.2
R6.7: MD1.26(P6_7) R61.2
R7.1: MD1.23(P7_1) R28.1
R7.2: MD1.22(P7_2) R29.1
R7.7: MD1.31(P7_7) R30.1
R9.0: MD1.17(P9_0) R31.1
R9.1: MD1.18(P9_1) R32.1
R9.2: MD1.21(P9_2) R33.1
R9.3: MD1.9(P9_3) R34.1
R9.4: MD1.14(P9_4) R35.1
R9.5: MD1.19(P9_5) R37.1
R9.6: MD1.20(P9_6) R39.1
R10.0: MD1.13(P10_0) R41.1
R10.1: MD1.12(P10_1) R43.1
R10.2: MD1.33(P10_2) R45.1
R10.3: MD1.7(P10_3) R47.1
R10.4: MD1.8(P10_4) R49.1
R10.5: MD1.11(P10_5) R51.1
R10.6: MD1.10(P10_6) R53.1
R12.6: MD1.34(P12_6) R54.1
R12.7: MD1.35(P12_7) R56.1
SCL_P5.0: R40.1 ; off-sheet SCL_P5.0
SDA_P5.1: R42.1 ; off-sheet SDA_P5.1
SERVO_P9.2: R33.2 ; off-sheet SERVO_P9.2
SWDCLK_P6.7: R61.1 ; off-sheet SWDCLK_P6.7
SWDIO_P6.6: R60.1 ; off-sheet SWDIO_P6.6
USR_LED1_P5.5: R50.1 ; off-sheet USR_LED1_P5.5
VBACKUP: MD1.3(VBACKUP) ; off-sheet VBACKUP
VREF: MD1.16(VREF) ; off-sheet VREF
XRES_N: MD1.42(~{XRES}) XRES_N.1 ; off-sheet XRES_N

### Notes on the sheet
- (near Y1) DESIGN NOTE:
  32.768KHz Crystal required for BLE
- DESIGN NOTE:
  Bypass Caps for MCU
- Title:
- Size:
- A
- Project
- Rev:
- Sheet:
- of
- College of Engineering
- 1415 Engineering Drive
- Madison, WI 53706

### Library data of the parts
C8 C9 = CMP-2007-04344-1: Manufacturer: KEMET; Manufacturer Part Number: CBR08C609C5GAC; Voltage Rating: 50V; Supplier: Newark; Supplier Part Number: 64AJ3970; RoHS: Yes; Category: Ceramic Capacitors; Stock: 1930; Pricing: 10=0.048, 25=0.048, 50=0.048, 100=0.048, 250=0.048, 500=0.048, 1000=0.048 (USD); Mounting Technology: Surface Mount; Case/Package: 0805; Min Operating Temperature: -55°C; Max Operating Temperature: 125°C; Packaging: Tape and Reel; Package Quantity: 4000; Series: CBR; Length: 0.079inch; Width: 0.049inch; Thickness: 0.035inch; RoHS Compliant: Yes; ComponentLink1URL: https://search.kemet.com/component-edge/download/datasheet/CBR08C609C5GAC.pdf?src-supplier=Digi-Key; ComponentLink1Description: https://search.kemet.com/component-edge/download/datasheet/CBR08C609C5GAC.pdf?src-supplier=Digi-Key
C10 = CMP-2007-03243-2: CAP CER 10UF 10V X5R 0805; Manufacturer: KEMET; Dielectric Material: Ceramic; Tolerance: 10%; Supplier: Newark; Supplier Part Number: 70K9138; Manufacturer Part Number: C0805C106K8PACTU; RoHS: Yes; Category: Ceramic Capacitors; Stock: 186414; Pricing: 1=0.141, 25=0.141, 50=0.141, 100=0.141, 250=0.141, 500=0.141, 1000=0.141 (USD); Mounting Technology: Surface Mount; Case/Package: 0805; Pins: 2; Contact Plating: Tin,Matte; Case Code (Imperial): 0805; Case Code (Metric): 2012; Min Operating Temperature: -55°C; Max Operating Temperature: 85°C; Packaging: Tape and Reel; Dielectric: X5R; Voltage Rating (DC): 10V; Termination: SMD/SMT; Package Quantity: 1; Voltage Rating: 10V; Voltage: 10V; Dissipation Factor: 10%; Series: C; Construction: Flat; Length: 2mm; Width: 0.049inch; Height: 1.25mm; Depth: 1.25mm; Thickness: 0.055inch; Radiation Hardening: No; Reach SVHC Compliant: No; RoHS Compliant: Yes; ComponentLink1URL: https://datasheet.ciiva.com/7842/1732709-7842198.pdf?src-supplier=Element14; ComponentLink1Description: https://datasheet.ciiva.com/7842/1732709-7842198.pdf?src-supplier=Element14
C11 = CMP-2007-00279-2: CAP CER 0.1UF 50V X7R 0805; Manufacturer: KEMET; Tolerance: 10%; Voltage: 500V; ComponentLink2Description: Datasheet; ComponentLink2URL: https://content.kemet.com/datasheets/KEM_C1003_C0G_SMD.pdf; Supplier: Newark; Supplier Part Number: 19C6015; Manufacturer Part Number: C0805C104K5RACTU; RoHS: Yes; Category: Ceramic Capacitors; Stock: 3382390; Pricing: 1=0.024, 25=0.024, 50=0.024, 100=0.024, 250=0.024, 500=0.024, 1000=0.024 (USD); Mounting Technology: Surface Mount,PCB; Case/Package: 0805; Pins: 2; Case Code (Imperial): 0805; Case Code (Metric): 2012; Min Operating Temperature: -55°C; Max Operating Temperature: 125°C; Package Quantity: 4000; Voltage Rating: 50V; Packaging: Tape and Reel; Voltage Rating (DC): 50V; Dielectric: X7R; Termination: SMD/SMT; Series: SMD Comm X7R; Construction: Flat; Length: 2mm; Width: 1.2mm; Height: 0.9mm; Lead Pitch: 0.75mm; Depth: 1.25mm; Radiation Hardening: No; RoHS Compliant: Yes; Reach SVHC Compliant: No; ComponentLink1URL: https://datasheet.ciiva.com/32431/slceramic-chip-condensers-e-32431755.pdf?src-supplier=Distrelec; ComponentLink1Description: https://datasheet.ciiva.com/32431/slceramic-chip-condensers-e-32431755.pdf?src-supplier=Distrelec; ComponentLink3URL: https://datasheet.ciiva.com/28682/1851736-28682232.pdf?src-supplier=Element14; ComponentLink3Description: https://datasheet.ciiva.com/28682/1851736-28682232.pdf?src-supplier=Element14
MD1 = CMP-12964-000002-1: RF TXRX MOD BLUETOOTH TRACE ANT; Manufacturer: Cypress Semiconductor; Manufacturer 1: Cypress; Number Of Gpio: 36; Number Of Adc Channels: 1; Max Supply Voltage: 3.6V; Min Supply Voltage: 1.71V; Data Rate: 2Mbits/s; Receiving Current: 6.7mA; Max Frequency: 2.5GHz; Bandwidth: 100MHz; Transmitting Current: 5.7mA; Interface: I2C,SPI,UART,I2S,Other; Octopart: https://octopart.com/cyble-416045-02-cypress+semiconductor-96386825; Lead Free: Yes; RoHS: TRUE; Device Class L3: Transceivers; Category: UNK; Package: 0; Device Class L2: RF Semiconductors and Devices; Automotive: No; ComponentLink2URL: https://www.cypress.com/file/428336/download; Temperature Range Low: -40°C; Height: 2mm; Device Class L1: Integrated Circuits (ICs); Manufacturer Part Number: CYBLE-416045-02; ComponentLink2Description: Datasheet; Digikey Description: RF TXRX MOD BLUETOOTH TRACE ANT; Temperature: -40°C to +85°C; Temperature Range High: +85°C; Supplier 1: Digi-Key; Supplier Part Number 1: 428-4622-1-ND; Manufacturer Part Number 1: CYBLE-416045-02; Stock 1: 3441; Pricing 1: 1=16.24000, 10=14.69300, 25=13.53280, 100=12.37280, 250=11.59952 (USD); RoHS Compliant: Yes
R28-R61 = CMP-2001-00580-1: Manufacturer: Yageo; Manufacturer Part Number: RC0805FR-07100RL; Power Rating: 125mW; Tolerance: 1%; Voltage Rating: 150V; Temperature Coefficient: 100ppm/°C; Application(s): HIGH RELIABILITY; Supplier: Newark; Supplier Part Number: 98K7775; RoHS: Yes; Category: Chip SMD Resistors; Stock: 1243890; Pricing: 1=0.102, 10=0.026, 25=0.021, 50=0.017, 100=0.013 (USD); Case Code (Imperial): 0805; Case Code (Metric): 2012; Weight: 0.000917oz; Min Operating Temperature: -55°C; Max Operating Temperature: 155°C; Packaging: Cut Tape; Package Quantity: 5000; Termination: SMD/SMT; Type: General Purpose; Series: RC; Technology: THICK FILM; Length: 2mm; Width: 1.25mm; Height: 0.5mm; Lead Free: Lead Free; RoHS Compliant: Yes; ComponentLink1URL: https://datasheet.ciiva.com/7941/1697719-7941680.pdf?src-supplier=Element14; ComponentLink1Description: https://datasheet.ciiva.com/7941/1697719-7941680.pdf?src-supplier=Element14; ComponentLink2URL: https://datasheet.ciiva.com/11808/0900766b8106beab-11808877.pdf?src-supplier=Rs; ComponentLink2Description: https://datasheet.ciiva.com/11808/0900766b8106beab-11808877.pdf?src-supplier=Rs; ComponentLink3URL: https://datasheet.ciiva.com/22747/444164-22747535.pdf?src-supplier=Element14; ComponentLink3Description: https://datasheet.ciiva.com/22747/444164-22747535.pdf?src-supplier=Element14; ComponentLink4URL: https://datasheet.ciiva.com/17082/rc0805-17082697.pdf?src-supplier=Future+Electronics; ComponentLink4Description: https://datasheet.ciiva.com/17082/rc0805-17082697.pdf?src-supplier=Future+Electronics; ComponentLink5URL: https://datasheet.ciiva.com/7941/1686128-7941679.pdf?src-supplier=Element14; ComponentLink5Description: https://datasheet.ciiva.com/7941/1686128-7941679.pdf?src-supplier=Element14; ComponentLink6URL: https://datasheet.ciiva.com/46447/444164-46447562.pdf?src-supplier=Element14; ComponentLink6Description: https://datasheet.ciiva.com/46447/444164-46447562.pdf?src-supplier=Element14; ComponentLink7URL: https://datasheet.ciiva.com/7660/38627-7660797.pdf?src-supplier=Element14; ComponentLink7Description: https://datasheet.ciiva.com/7660/38627-7660797.pdf?src-supplier=Element14
XRES_N = CMP-1672-00008-1: Test Point, 1 Position SMD, RoHS, Tape and Reel; Manufacturer: Keystone Electronics; Plating: Silver; Body Material: Bronze; Supplier: Newark; Supplier Part Number: 59Y8500; Manufacturer Part Number: 5019; RoHS: Yes; Category: Connectors; Stock: 11269; Pricing: 1=0.411, 10=0.389, 25=0.285, 50=0.279, 100=0.273, 250=0.246 (USD); Mounting Technology: Surface Mount,PCB; Pins: 1; Contact Plating: Silver; Contact Material: Bronze; Material: Bronze; Packaging: Tape and Reel; Package Quantity: 1; Termination: SMD/SMT; Series: 5019; Height: 0.09inch; Reach SVHC Compliant: No; RoHS Compliant: Yes; Lead Free: Lead Free; ComponentLink1URL: https://datasheet.ciiva.com/14848/m60-2p61-14848437.pdf?src-supplier=Digi-Key; ComponentLink1Description: https://datasheet.ciiva.com/14848/m60-2p61-14848437.pdf?src-supplier=Digi-Key; ComponentLink2URL: https://datasheet.ciiva.com/14848/m60-2p61-14848438.pdf?src-supplier=Digi-Key; ComponentLink2Description: https://datasheet.ciiva.com/14848/m60-2p61-14848438.pdf?src-supplier=Digi-Key; ComponentLink3URL: https://datasheet.ciiva.com/14848/m60-2p61-14848439.pdf?src-supplier=Digi-Key; ComponentLink3Description: https://datasheet.ciiva.com/14848/m60-2p61-14848439.pdf?src-supplier=Digi-Key; ComponentLink4URL: https://datasheet.ciiva.com/16318/m60-2p61-16318395.pdf?src-supplier=Future+Electronics; ComponentLink4Description: https://datasheet.ciiva.com/16318/m60-2p61-16318395.pdf?src-supplier=Future+Electronics; ComponentLink5URL: https://datasheet.ciiva.com/16885/70182998-16885945.pdf?src-supplier=Allied+Electronics; ComponentLink5Description: https://datasheet.ciiva.com/16885/70182998-16885945.pdf?src-supplier=Allied+Electronics
Y1 = CMP-2000-07587-2: CRYSTAL 32.7680KHZ 6PF SMD; Manufacturer: Abracon; Manufacturer Part Number: ABS07-120-32.768KHZ-T; Tolerance: 20ppm; ESR (Equivalent Series Resistance): 55kR; ESR: 60kR; Supplier: Newark; Supplier Part Number: 56AC7523; RoHS: Yes; Category: Crystals; Stock: 20747; Pricing: 1=0.587, 25=0.587, 50=0.587, 100=0.587, 250=0.587, 500=0.587, 1000=0.532 (USD); Mounting Technology: Surface Mount; Case/Package: SMD/SMT; Pins: 2; Min Operating Temperature: -40°C; Max Operating Temperature: 85°C; Frequency: 32.768kHz; Load Capacitance: 6pF; Frequency Tolerance: 20ppm; Packaging: Tape and Reel; Package Quantity: 3000; Termination: SMD/SMT; Series: ABS07; Operating Frequency: 32.768 kHz; Length: 3.2mm; Width: 1.5mm; Height: 0.9mm; Depth: 1.5mm; Radiation Hardening: No; Reach SVHC Compliant: No; Lead Free: Lead Free; RoHS Compliant: Yes; ComponentLink1URL: https://datasheet.ciiva.com/6728/abs07-120-32-768khz-t-6728893.pdf?src-supplier=Digi-Key; ComponentLink1Description: https://datasheet.ciiva.com/6728/abs07-120-32-768khz-t-6728893.pdf?src-supplier=Digi-Key; ComponentLink2URL: https://datasheet.ciiva.com/12387/abs07-120-32-768khz-t-218607-12387629.pdf?src-supplier=Mouser; ComponentLink2Description: https://datasheet.ciiva.com/12387/abs07-120-32-768khz-t-218607-12387629.pdf?src-supplier=Mouser